# EAGLE design Serial Controlled Module (EAGLE 7.5.0)
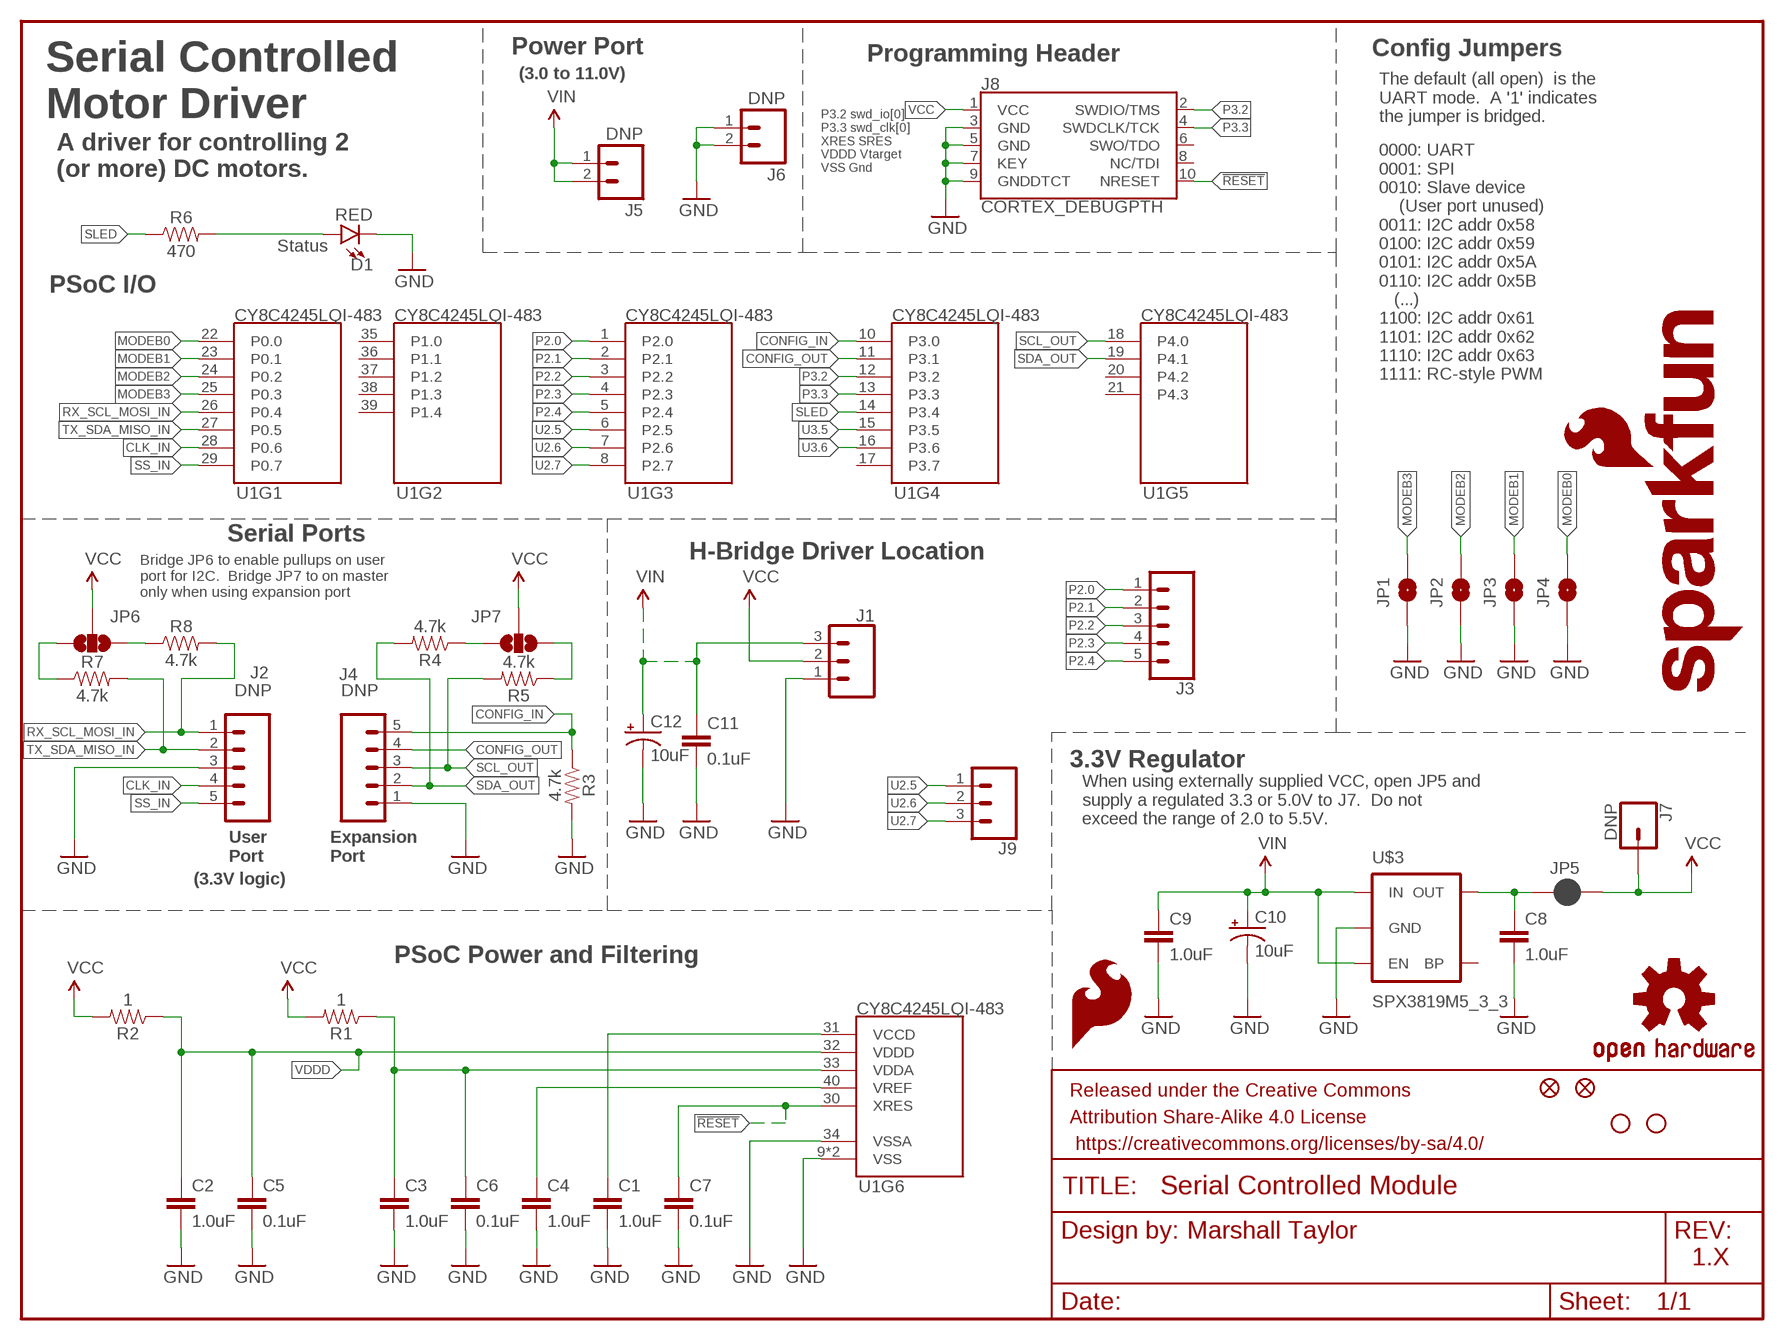
[diagram p0: schematic, sheet 1]

## Parts
C1  1.0uF  1.0UF-0402-16V-10%  [0402]
C2  1.0uF  1.0UF-0402-16V-10%  [0402]
C3  1.0uF  1.0UF-0402-16V-10%  [0402]
C4  1.0uF  1.0UF-0402-16V-10%  [0402]
C5  0.1uF  0.1UF-0402-16V-10%  [0402]
C6  0.1uF  0.1UF-0402-16V-10%  [0402]
C7  0.1uF  0.1UF-0402-16V-10%  [0402]
C8  1.0uF  1.0UF-0402-16V-10%  [0402]
C9  1.0uF  1.0UF-0402-16V-10%  [0402]
C10  10uF  10UF-POLAR-EIA3216-16V-10%(TANT)  [EIA3216]
C11  0.1uF  0.1UF-0402-16V-10%  [0402]
C12  10uF  10UF-POLAR-EIA3216-16V-10%(TANT)  [EIA3216]
D1  RED  LED-RED0603  [LED-0603]
FD1  FIDUCIALUFIDUCIAL  [MICRO-FIDUCIAL]
FD2  FIDUCIALUFIDUCIAL  [MICRO-FIDUCIAL]
FRAME1  FRAME-LETTER  [CREATIVE_COMMONS]
H3  STAND-OFF  [STAND-OFF]
H4  STAND-OFF  [STAND-OFF]
J1  CONN_03PTH  [1X03]
J2  DNP  M05PTH  [1X05@1]
J3  CONN_05PTH  [1X05]
J4  DNP  M05PTH  [1X05@1]
J5  DNP  M02PTH  [1X02@1]
J6  DNP  M02PTH  [1X02@1]
J7  DNP  CONN_01PTH  [1X01]
J8  CORTEX_DEBUGPTH  [2X5-PTH-1.27MM]
J9  CONN_03PTH  [1X03]
JP1  JUMPER-PAD-2  JUMPER-PAD-2-NOYES_SILK  [PAD-JUMPER-2-NO_YES_SILK]
JP2  JUMPER-PAD-2  JUMPER-PAD-2-NOYES_SILK  [PAD-JUMPER-2-NO_YES_SILK]
JP3  JUMPER-PAD-2  JUMPER-PAD-2-NOYES_SILK  [PAD-JUMPER-2-NO_YES_SILK]
JP4  JUMPER-PAD-2  JUMPER-PAD-2-NOYES_SILK  [PAD-JUMPER-2-NO_YES_SILK]
JP5  JUMPER-PAD-2  JUMPER-PAD-2-NC_BY_PASTE  [PAD-JUMPER-2-NC_BY_PASTE_YES_SILK]
JP6  JUMPER-PAD-3-NOYES_SILK  [PAD-JUMPER-3-NO_YES_SILK]
JP7  JUMPER-PAD-3-NOYES_SILK  [PAD-JUMPER-3-NO_YES_SILK]
LOGO1  SFE_LOGO_FLAME.1_INCH  [SFE_LOGO_FLAME_.1]
LOGO2  OSHW-LOGOMINI  [OSHW-LOGO-MINI]
LOGO3  SFE_LOGO_NAME_FLAME.1_INCH  [SFE_LOGO_NAME_FLAME_.1]
R1  1  1OHM-0603-1/10W-1%  [0603]
R2  1  1OHM-0603-1/10W-1%  [0603]
R3  4.7k  4.7KOHM-0603-1/10W-1%  [0603]
R4  4.7k  4.7KOHM-0603-1/10W-1%  [0603]
R5  4.7k  4.7KOHM-0603-1/10W-1%  [0603]
R6  470  470OHM-0603-1/10W-1%  [0603]
R7  4.7k  4.7KOHM-0603-1/10W-1%  [0603]
R8  4.7k  4.7KOHM-0603-1/10W-1%  [0603]
U1  CY8C4245LQI-483  CY8C4245LQI  [QFN-40]
U$3  SPX3819M5_3_3  SPX3819  [SOT-23-5-VREG]

## Nets
!RESET: C7.1 J8.10(NRESET) U1.30(XRES)
CLK_IN: J2.4 U1.28(P0.6)
CONFIG_IN: J4.5 R3.1 U1.10(P3.0)
CONFIG_OUT: J4.4 U1.11(P3.1)
GND: C1.2 C2.2 C3.2 C4.2 C5.2 C6.2 C7.2 C8.2 C9.2 C10.- C11.2 C12.- D1.C J1.1 J2.3 J4.1 J6.1 J6.2 J8.3(GND) J8.5(GND) J8.7(KEY) J8.9(GNDDTCT) JP1.1 JP2.1 JP3.1 JP4.1 R3.2 U1.9(VSS) U1.34(VSSA) U1.EP(VSS) U$3.2(GND)
MODEB0: JP4.2 U1.22(P0.0)
MODEB1: JP3.2 U1.23(P0.1)
MODEB2: JP2.2 U1.24(P0.2)
MODEB3: JP1.2 U1.25(P0.3)
N$1: C1.1 U1.31(VCCD)
N$2: JP7.1 R4.1
N$3: C3.1 C6.1 R1.1 U1.33(VDDA)
N$4: C4.1 U1.40(VREF)
N$5: C8.1 JP5.1 U$3.5(OUT)
N$6: JP7.3 R5.1
N$10: D1.A R6.2
N$11: JP6.1 R8.1
N$12: JP6.3 R7.1
P2.0: J3.1 U1.1(P2.0)
P2.1: J3.2 U1.2(P2.1)
P2.2: J3.3 U1.3(P2.2)
P2.3: J3.4 U1.4(P2.3)
P2.4: J3.5 U1.5(P2.4)
P3.2: J8.2(SWDIO/TMS) U1.12(P3.2)
P3.3: J8.4(SWDCLK/TCK) U1.13(P3.3)
RX_SCL_MOSI_IN: J2.1 R8.2 U1.26(P0.4)
SCL_OUT: J4.3 R5.2 U1.18(P4.0)
SDA_OUT: J4.2 R4.2 U1.19(P4.1)
SLED: R6.1 U1.14(P3.4)
SS_IN: J2.5 U1.29(P0.7)
TX_SDA_MISO_IN: J2.2 R7.2 U1.27(P0.5)
U2.5: J9.1 U1.6(P2.5)
U2.6: J9.2 U1.7(P2.6)
U2.7: J9.3 U1.8(P2.7)
U3.5: U1.15(P3.5)
U3.6: U1.16(P3.6)
VCC: J1.2 J7.1 J8.1(VCC) JP5.2 JP6.2 JP7.2 R1.2 R2.2
VDDD: C2.1 C5.1 R2.1 U1.32(VDDD)
VIN: C9.1 C10.+ C11.1 C12.+ J1.3 J5.1 J5.2 U$3.1(IN) U$3.3(EN)
Unconnected: J8.6(SWO/TDO) J8.8(NC/TDI) U1.17(P3.7) U1.20(P4.2) U1.21(P4.3) U1.35(P1.0) U1.36(P1.1) U1.37(P1.2) U1.38(P1.3) U1.39(P1.4) U$3.4(BP)

## Notes on the sheet
- Serial Controlled
  Motor Driver
- Power Port | Programming Header | Config Jumpers
- The default (all open)  is the
  UART mode.  A '1' indicates
  the jumper is bridged.
- (3.0 to 11.0V)
- P3.2 swd_io[0]
  P3.3 swd_clk[0]
  XRES SRES
  VDDD Vtarget
  VSS Gnd
- A driver for controlling 2
  (or more) DC motors.
- 0000: UART
  0001: SPI
  0010: Slave device
      (User port unused)
  0011: I2C addr 0x58
  0100: I2C addr 0x59
  0101: I2C addr 0x5A
  0110: I2C addr 0x5B
     (...)
  1100: I2C addr 0x61
  1101: I2C addr 0x62
  1110: I2C addr 0x63
  1111: RC-style PWM
- Status
- PSoC I/O
- Serial Ports
- Bridge JP6 to enable pullups on user
  port for I2C.  Bridge JP7 to on master
  only when using expansion port
- H-Bridge Driver Location
- 3.3V Regulator
- When using externally supplied VCC, open JP5 and
  supply a regulated 3.3 or 5.0V to J7.  Do not
  exceed the range of 2.0 to 5.5V.
- User
  Port
- Expansion
  Port
- (3.3V logic)
- PSoC Power and Filtering
- Marshall Taylor
- 1.X

## Library data of the parts
C1-C4 C8 C9 = SparkFun-Capacitors:1.0UF: 1µF ceramic capacitors A capacitor is a passive two-terminal electrical component used to store electrical energy temporarily in an electric field.; PROD_ID: CAP-12417
C5-C7 C11 = SparkFun-Capacitors:0.1UF: 0.1µF ceramic capacitors A capacitor is a passive two-terminal electrical component used to store electrical energy temporarily in an electric field.; PROD_ID: CAP-12416
C10 C12 = SparkFun-Capacitors:10UF-POLAR: 10.0µF polarized capacitors A capacitor is a passive two-terminal electrical component used to store electrical energy temporarily in an electric field.; PROD_ID: CAP-00811
D1 = SparkFun-LED:LED-RED: Red SMD LED Used in manufacturing of most products at SparkFun Packages: 0603 - SMD 0603 package [Product Link] <http://docs.avagotech.com/docs/AV02-0551EN> 0603 SMART - SMD 0603 SMART package ( more efficient and expensive)[Product Link] <http://www.osram-os.com/Graphics/XPic2/00077099_0.pdf> 1206 - SMD1206 package [Product Link] <https://www.sparkfun.com/datasheets/DevTools/LilyPad/Q150OVS4.pdff> SparkFun Products: Pro Mini 328 -5V <https://www.sparkfun.com/products/821> RedBoard <https://www.sparkfun.com/products/12757> IOIO-OTG <https://www.sparkfun.com/products/13613>; PROD_ID: DIO-00819
FD1 FD2 = SparkFun-Aesthetics:FIDUCIAL: Fiducial Alignment Points Various fiducial points for machine vision alignment.
FRAME1 = SparkFun-Aesthetics:FRAME-LETTER: Schematic Frame Standard 8.5x11 US Letter frame
H3 H4 = SparkFun-Electromechanical:STAND-OFF: #4 Stand Off This is the mechanical footprint for a #4 phillips button head screw. Use the keepout ring to avoid running the screw head into surrounding components. SKU : PRT-00447
J1 J9 = SparkFun-Connectors:CONN_03: Header 3 Standard 3-pin 0.1" header. Use with straight break away headers (SKU : PRT-00116), right angle break away headers (PRT-00553), swiss pins (PRT-00743), machine pins (PRT-00117), and female headers (PRT-00115). Molex polarized connector foot print use with SKU : PRT-08232 with associated crimp pins and housings.
J2 J4 = SparkFun-Connectors:M05: Header 5 Standard 5-pin 0.1" header. Use with straight break away headers (SKU : PRT-00116), right angle break away headers (PRT-00553), swiss pins (PRT-00743), machine pins (PRT-00117), and female headers (PRT-00115). Molex polarized connector foot print use with SKU : PRT-08230 with associated crimp pins and housings.
J3 = SparkFun-Connectors:CONN_05: Header 5 Standard 5-pin 0.1" header. Use with straight break away headers (SKU : PRT-00116), right angle break away headers (PRT-00553), swiss pins (PRT-00743), machine pins (PRT-00117), and female headers (PRT-00115). Molex polarized connector foot print use with SKU : PRT-08230 with associated crimp pins and housings.
J5 J6 = SparkFun-Connectors:M02: Standard 2-pin 0.1" header. Use with - straight break away headers ( PRT-00116) - right angle break away headers (PRT-00553) - swiss pins (PRT-00743) - machine pins (PRT-00117) - female headers (PRT-00115) Molex polarized connector foot print use with: PRT-08233 with associated crimp pins and housings. 2.54_SCREWTERM for use with PRT-10571. 3.5mm Screw Terminal footprints for PRT-08084 5mm Screw Terminal footprints for use with PRT-08432
J7 = SparkFun-Connectors:CONN_01: Header 1 Standard 1-pin 0.1" header. Use with straight break away headers (SKU : PRT-00116), right angle break away headers (PRT-00553), swiss pins (PRT-00743), machine pins (PRT-00117), and female headers (PRT-00115). SMTSO-256-ET is a "flush mount" nut for a 4-40 screw. The older package used to be too tight, and did not allow it to sit properly thru the drill hit. The latest (0.165DIA) fits nice and snug.
J8 = Pete_Connectors_Retired:CORTEX_DEBUG: Cortex Debug Connector Datasheet <http://infocenter.arm.com/help/topic/com.arm.doc.faqs/attached/13634/cortex_debug_connectors.pdf>
JP1-JP4 = SparkFun-Passives:JUMPER-PAD-2-NO
JP5 = SparkFun-Jumpers:JUMPER-PAD-2-NC_BY_PASTE
JP6 JP7 = SparkFun-Passives:JUMPER-PAD-3-NO
LOGO1 = SparkFun-Aesthetics:SFE_LOGO_FLAME: SFE Logo, flame only This is the SparkFun flame logo. The logo on the schematic will always be the same size; the package variant is the height of the flame. Default layer for the logo on the board is tSilk.
LOGO2 = SparkFun-Aesthetics:OSHW-LOGO: Open Source Hardware Logo This logo indicates the piece of hardware it is found on incorporates a OSHW license and/or adheres to the definition of open source hardware found here: http://freedomdefined.org/OSHW
LOGO3 = SparkFun-Aesthetics:SFE_LOGO_NAME_FLAME: SFE Logo, name and flame This is the SparkFun full logo. The logo on the schematic will always be the same size; the package variant is the height of the flame part of the logo. Default layer for the logo on the board is tSilk.
R1 R2 = SparkFun-Resistors:1OHM: 1Ω resistor A resistor is a passive two-terminal electrical component that implements electrical resistance as a circuit element. Resistors act to reduce current flow, and, at the same time, act to lower voltage levels within circuits.; PROD_ID: RES-08269
R3-R5 R7 R8 = SparkFun-Resistors:4.7KOHM: 4.7kΩ resistor A resistor is a passive two-terminal electrical component that implements electrical resistance as a circuit element. Resistors act to reduce current flow, and, at the same time, act to lower voltage levels within circuits.; PROD_ID: RES-07857
R6 = SparkFun-Resistors:470OHM: 470Ω resistor A resistor is a passive two-terminal electrical component that implements electrical resistance as a circuit element. Resistors act to reduce current flow, and, at the same time, act to lower voltage levels within circuits.; PROD_ID: RES-07869
U1 = PSOC4TempLib:CY8C4245LQI: PSOC 4200; PROD_ID: IC-13292
U$3 = PSOC4TempLib:SPX3819; PROD_ID: VREG-13321

## Board
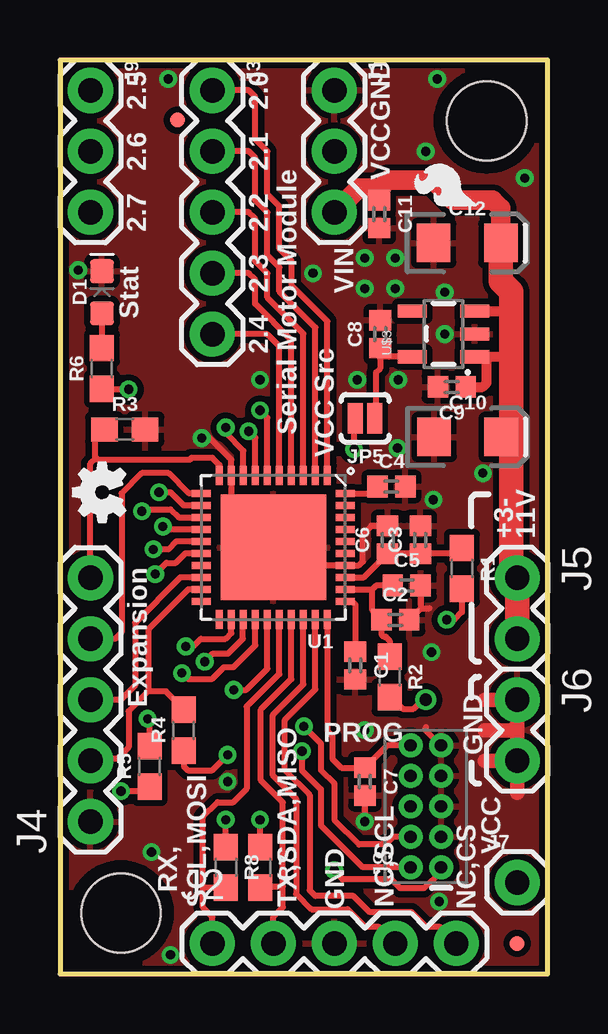
[diagram p1: board, top side]
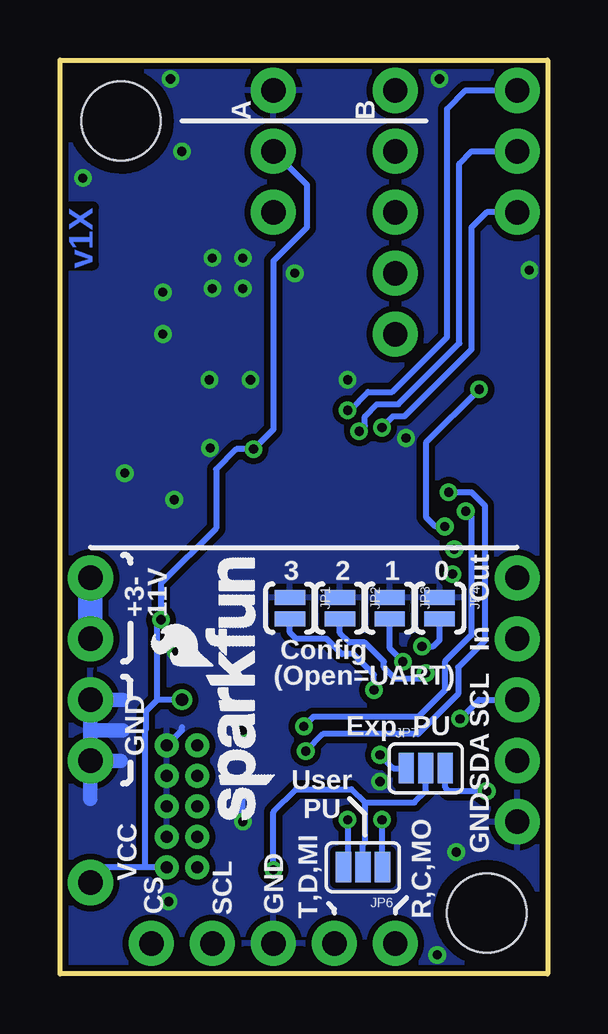
[diagram p2: board, bottom side, seen from below]

Size 20.32 x 38.1 mm. Coordinates in mm from the lower left corner, seen from the top.
Outline: 0,0 20.32,0 20.32,38.1 0,38.1 0,0
Copper layers (1*16): Top 0.035mm / dielectric 1.5mm / Bottom 0.035mm
Design rules "SparkFun-2-layer-TIGHT": minimum track width 7mil, minimum drill 15mil, track to track 7mil, track to pad 7mil, pad to pad 7mil, via to via 7mil, smd to smd 7mil, copper to edge 7mil, drill to drill 7mil, minimum pad ring 7mil, minimum via ring 7mil, stop-mask expansion 4mil, vias tented up to drill 25mil, thermal gap 10mil

### Footprints (pad centres in the part's own frame; a part is rotated, then mirrored left to right if it is on the bottom)
0402 = smd 0.85 x 0.9: 1 -0.58,0; 2 0.58,0
EIA3216 = smd 1.4 x 1.6: + 1.4,0; - -1.4,0
LED-0603 = smd 1 x 1: A -0.877,0; C 0.877,0
MICRO-FIDUCIAL = smd 0.635 x 0.635: 1 0,0
STAND-OFF = hole 3.302: 0,0
1X03 = drill 1.016 pad 1.88: 1 0,0; 2 2.54,0; 3 5.08,0
1X05@1 = drill 1.016 pad 1.88: 1 0,0; 2 2.54,0; 3 5.08,0; 4 7.62,0; 5 10.16,0
1X05 = drill 1.016 pad 1.88: 1 0,0; 2 2.54,0; 3 5.08,0; 4 7.62,0; 5 10.16,0
1X02@1 = drill 1.016 pad 1.88: 1 0,0; 2 2.54,0
1X01 = drill 1.016 pad 1.88: 1 0,0
2X5-PTH-1.27MM = drill 0.508 pad 1: 1 -2.54,-0.635; 2 -2.54,0.635; 3 -1.27,-0.635; 4 -1.27,0.635; 5 0,-0.635; 6 0,0.635; 7 1.27,-0.635; 8 1.27,0.635; 9 2.54,-0.635; 10 2.54,0.635
PAD-JUMPER-2-NO_YES_SILK = smd 0.635 x 1.27: 1 -0.45,0; 2 0.45,0
PAD-JUMPER-2-NC_BY_PASTE_YES_SILK = smd 0.635 x 1.27: 1 -0.401,0; 2 0.413,0
PAD-JUMPER-3-NO_YES_SILK = smd 0.635 x 1.27: 1 -0.813,0; 2 0,0; 3 0.813,0
0603 = smd 1.1 x 1: 1 -0.85,0; 2 0.85,0
QFN-40 = smd 0.285 x 0.8: 1 -2.25,-3; 2 -1.75,-3; 3 -1.25,-3; 4 -0.75,-3; 5 -0.25,-3; 6 0.25,-3; 7 0.75,-3; 8 1.25,-3; 9 1.75,-3; 10 2.25,-3; 21 2.25,3; 22 1.75,3; 23 1.25,3; 24 0.75,3; 25 0.25,3; 26 -0.25,3; 27 -0.75,3; 28 -1.25,3; 29 -1.75,3; 30 -2.25,3 | smd 0.8 x 0.285: 11 3,-2.25; 12 3,-1.75; 13 3,-1.25; 14 3,-0.75; 15 3,-0.25; 16 3,0.25; 17 3,0.75; 18 3,1.25; 19 3,1.75; 20 3,2.25; 31 -3,2.25; 32 -3,1.75; 33 -3,1.25; 34 -3,0.75; 35 -3,0.25; 36 -3,-0.25; 37 -3,-0.75; 38 -3,-1.25; 39 -3,-1.75; 40 -3,-2.25 | smd 4.4 x 4.4: EP 0,0
SOT-23-5-VREG = smd 0.55 x 1.2: 1 -0.95,-1.3; 2 0,-1.3; 3 0.95,-1.3; 4 0.95,1.3; 5 -0.95,1.3

### Placement (x,y rotation side)
C1  12.3,12.86 270 top
C2  13.97,14.76 0 top
C3  15.02,18.1 90 top
C4  13.81,20.32 0 top
C5  14.45,16.19 0 top
C6  13.65,18.1 90 top
C7  12.7,8.02 270 top
C8  13.34,26.67 90 top
C9  16.33,24.47 180 top
C10  16.99,22.38 0 top
C11  13.3,31.67 270 top
C12  16.97,30.47 0 top
D1  1.75,28.42 90 top
FD1  19.05,1.27 90 top
FD2  4.89,35.59 90 top
FRAME1  -21.59,-27.94 0 top  (outside the outline)
H3  17.78,35.56 0 top
H4  2.54,2.54 0 top
J1  11.43,36.83 270 top
J2  6.35,1.27 0 top
J3  6.35,36.83 270 top
J4  1.27,6.35 90 top
J5  19.05,16.51 270 top
J6  19.05,11.43 270 top
J7  19.05,3.81 0 top
J8  15.24,6.99 90 top
J9  1.27,36.83 270 top
JP1  10.74,15.25 270 bottom
JP2  8.66,15.25 270 bottom
JP3  6.58,15.25 270 bottom
JP4  4.5,15.25 270 bottom
JP5  12.72,23.16 180 top
JP6  7.7,4.45 180 bottom
JP7  5.08,8.57 0 bottom
LOGO1  17.68,31.73 90 top
LOGO2  1.75,20.08 90 top
LOGO3  11.31,5.99 90 bottom
R1  16.75,16.91 270 top
R2  13.73,12.38 270 top
R3  2.7,22.7 0 top
R4  5.16,10.16 90 top
R5  3.73,8.65 90 top
R6  1.75,25.24 90 top
R7  8.33,4.45 270 top
R8  6.91,4.45 270 top
U1  8.89,17.78 180 top
U$3  15.98,26.68 90 top

### Tracks (layer width: path | path; a pad name or v marks a point on that pad's centre or on a via)
!RESET
  Top 0.254: U1.30 11.14,10.13 11.35,9.92 11.35,8.97 11.72,8.6 C7.1 13.63,9.53 J8.10
CLK_IN
  Top 0.254: J2.4 13.26,1.98 12.7,1.98 11.99,2.7 10.48,2.7 9.84,3.33 9.84,7.3 8.87,8.28 8.87,10.81 10.14,12.08 U1.28
CONFIG_IN
  Top 0.254: U1.10 6.64,21.22 6.35,21.51 5.48,21.51 5.4,21.43 1.59,21.43 1.51,21.51 | J4.5 1.27,21.27 1.51,21.51 | R3.1 1.75,22.7 1.45,22.41 1.45,21.57 1.51,21.51
CONFIG_OUT
  Top 0.254: J4.4 2.3,13.97 2.57,14.24 2.57,20.03 3.41,20.88 4.52,20.88 5.37,20.03 U1.11
GND  (via drill 0.38)
  Top 0.254: C6.2 12.96,18.68 12.62,18.34 12.62,17.19 12.46,17.03 U1.34 10.67,17.03 10.48,17.22 9.45,17.22 U1.EP | 7.38,19.21 7.14,19.45 U1.9 7.14,21.43 6.19,22.38 | C7.2 v12.7,6.35 | C1.2 12.28,12.28 | C5.2 15.03,15.24 | 15.03,15.24 C2.2 | 15.03,15.24 15.4,15.24 | J8.9 15.24,10.16 15.24,10.29
  Top 0.61: 17.7,10.16 19.05,10.16 | 17.7,11.43 J6.1 19.05,10.16 | 17.7,8.89 J6.2 | 19.05,7.54 J6.2 | J6.2 19.05,10.16
  Bottom 0.254: v12.7,6.35 12.7,7.62 | J8.9 15.24,10.16 15.24,10.29
  Bottom 0.61: 17.7,11.43 J6.1 19.05,10.16 | 19.05,10.16 J6.2 | J6.2 19.05,7.3 | J6.2 17.78,8.89 | 19.05,10.16 17.7,10.16
  other vias: 19.37,33.18 15.72,37.31 13.97,28.57 13.97,29.84 12.7,29.84 15.24,34.29 4.51,37.31 16.03,26.67 16.03,28.42 17.62,20.88 15.56,19.76 14.1,24.77 14.07,21.92 8.33,24.77 0.76,29.34 15.48,13.41 15.8,3.02 3.81,5.08 6.99,8.02 12.7,10.16 4.6,0.79 5.91,22.34 10.54,29.21 12.38,24.77 12.7,28.57
  pour Bottom (isolate 0.254): 0,38.1 0,0 20.32,0 20.32,38.1
  pour Top (isolate 0.254, rank 2): 0,38.1 0,0 20.32,0 20.32,38.1
MODEB0  (via drill 0.38)
  Top 0.254: v5.24,13.65 5.56,13.65 5.87,13.97 6.9,13.97 7.14,14.2 U1.22
  Bottom 0.254: v5.24,13.65 4.76,13.65 4.5,13.91 JP4.2
MODEB1  (via drill 0.38)
  Top 0.254: v6.03,13.02 6.37,13.36 7,13.36 7.62,13.97 7.62,14.76 U1.23
  Bottom 0.254: v6.03,13.02 6.58,13.56 JP3.2
MODEB2  (via drill 0.38)
  Top 0.254: v5.08,12.54 5.32,12.3 6.35,12.3 6.83,12.78 7.22,12.78 8.14,13.7 U1.24
  Bottom 0.254: JP2.2 8.66,14.22 8.26,13.81 7.62,13.81 6.83,13.02 6.83,12.78 6.35,12.3 5.32,12.3 v5.08,12.54
MODEB3  (via drill 0.38)
  Top 0.254: v7.24,11.84 7.76,11.84 8.64,12.72 U1.25
  Bottom 0.254: JP1.2 10.74,14.23 10.48,13.97 9.21,13.97 8.57,13.34 8.1,13.34 7.24,12.48 v7.24,11.84
N$1
  Top 0.254: U1.31 12.17,15.53 12.3,15.4 C1.1
N$2  (via drill 0.38)
  Top 0.254: R4.1 5.16,8.65 5.32,8.49 6.35,8.49 v6.99,9.13
  Bottom 0.254: v6.99,9.13 6.43,8.57 JP7.1
N$3
  Top 0.254: U1.33 12.66,16.53 C6.1 C3.1 16.51,17.52 R1.1
N$4
  Top 0.254: U1.40 12.94,20.03 C4.1
N$5
  Top 0.203: 13.41,25.73 13.34,25.65
  Top 0.254: U$3.5 13.71,25.73 | 13.71,25.73 C8.1 | 13.71,25.73 13.41,25.73 | 13.34,25.65 13.34,25.24 13.17,25.07 13.17,23.16 JP5.1
N$6  (via drill 0.38)
  Top 0.254: R5.1 3.55,7.62 v2.54,7.62
  Bottom 0.254: v2.54,7.62 4.13,7.62 4.27,7.76 JP7.3
N$10
  Top 0.254: D1.A R6.2
N$11  (via drill 0.38)
  Top 0.254: R8.1 v6.91,6.43
  Bottom 0.254: v6.91,6.43 6.91,4.46 JP6.1
N$12  (via drill 0.38)
  Top 0.254: R7.1 v8.33,6.43
  Bottom 0.254: v8.33,6.43 8.33,4.62 JP6.3
P2.0
  Top 0.254: U1.1 11.14,27.21 9.65,28.7 9.65,29.72 9.14,30.23 9.14,32 8.64,32.51 8.64,34.29 8.13,34.8 8.13,36.58 7.87,36.83 J3.1
P2.1
  Top 0.254: U1.2 10.64,26.95 9.14,28.45 9.14,29.46 8.64,29.97 8.64,31.75 8.13,32.26 8.13,34.04 7.87,34.29 J3.2
P2.2
  Top 0.254: U1.3 10.14,26.69 8.64,28.19 8.64,29.21 8.13,29.72 8.13,31.5 7.87,31.75 J3.3
P2.3
  Top 0.254: U1.4 9.64,26.43 8.13,27.94 8.13,28.96 7.87,29.21 J3.4
P2.4
  Top 0.254: U1.5 9.14,26.17 8.64,26.67 J3.5
P3.2  (via drill 0.38)
  Top 0.254: J8.2 12.62,4.45 10.87,6.19 10.87,7.7 10.08,8.49 v10.08,9.29 | v4.13,20.08 4.6,20.08 5.16,19.53 U1.12
  Bottom 0.254: v10.08,9.29 9.37,10 5.4,10 3.73,11.67 3.73,12.78 2.62,13.89 2.62,19.53 3.17,20.08 v4.13,20.08
P3.3  (via drill 0.38)
  Top 0.254: v10.16,10.32 10.87,9.6 10.87,8.49 11.43,7.94 11.43,6.43 12.46,5.4 13.57,5.4 13.89,5.71 J8.4 | v3.41,19.29 3.49,19.37 4.6,19.37 4.94,19.03 U1.13
  Bottom 0.254: v10.16,10.32 9.76,10.72 5.4,10.72 4.29,11.83 4.29,13.02 3.17,14.13 3.17,19.05 v3.41,19.29
RX_SCL_MOSI_IN
  Top 0.254: J2.1 6.35,2.38 5.95,2.78 5.95,3.57 | 5.95,3.57 5.95,6.54 6.57,7.16 7.22,7.16 7.78,7.71 7.78,11.14 9.14,12.51 U1.26 | R8.2 5.98,3.6 5.95,3.57
SCL_OUT  (via drill 0.38)
  Top 0.254: U1.18 5.02,16.53 3.13,14.64 3.13,12.02 2.54,11.43 J4.3 | R5.2 3.73,10.56 v3.65,10.64
  Bottom 0.254: v3.65,10.64 2.86,11.43 J4.3
SDA_OUT
  Top 0.254: U1.19 5.35,16.03 3.68,14.37 3.68,11.78 | 3.68,11.78 2.86,10.95 2.86,9.45 2.38,8.97 1.35,8.97 J4.2 | R4.2 5.16,11.03 4.41,11.78 3.68,11.78
SLED  (via drill 0.38)
  Top 0.254: v2.86,24.37 1.77,24.37 R6.1 | U1.14 4.41,18.53 v4.29,18.65
  Bottom 0.254: v4.29,18.65 4.68,18.65 5.08,19.05 5.08,22.15 v2.86,24.37
SS_IN
  Top 0.254: J2.5 15.8,1.98 15.24,1.98 14.65,2.57 12.91,2.57 12.22,3.25 10.64,3.25 10.4,3.49 10.4,7.46 9.37,8.49 9.37,10.59 10.64,11.86 U1.29
TX_SDA_MISO_IN
  Top 0.254: J2.2 8.89,2.38 9.29,2.78 9.29,3.65 | 9.29,3.65 9.29,7.14 8.37,8.06 8.37,11.02 9.64,12.29 U1.27 | R7.2 8.39,3.65 9.29,3.65
U2.5  (via drill 0.38)
  Top 0.254: U1.6 8.64,23.19 v8.33,23.5
  Bottom 0.254: v8.33,23.5 8.26,23.5 7.49,24.26 6.48,24.26 4.19,26.54 4.19,36.07 3.43,36.83 J9.1
U2.6  (via drill 0.38)
  Top 0.254: U1.7 8.14,22.34 v7.86,22.62
  Bottom 0.254: v7.86,22.62 7.62,22.86 7.62,23.24 7.11,23.75 6.22,23.75 3.68,26.29 3.68,33.78 3.17,34.29 J9.2
U2.7  (via drill 0.38)
  Top 0.254: U1.8 7.64,21.81 6.91,22.54 v6.91,22.78
  Bottom 0.254: J9.3 2.54,31.75 3.17,31.11 3.17,26.04 5.97,23.24 6.45,23.24 v6.91,22.78
U3.5  (via drill 0.38)
  Top 0.254: U1.15 4.85,18.03 4.52,17.7 v3.89,17.7
U3.6  (via drill 0.38)
  Top 0.254: U1.16 5.23,17.53 4.83,17.13 4.43,17.13 v3.97,16.67
VCC  (via drill 0.38, 0.51)
  Top 0.254: J8.1 15.88,4.29 15.16,3.57 14.18,3.57 13.81,3.94 11.78,3.94 11.43,4.29 v11.43,4.33 | 13.81,11.51 13.49,11.19 | R1.2 16.75,15.08 16.43,14.76 v16.11,14.76 | 13.81,11.51 14.27,11.05 14.73,11.05 15.11,11.43 v15.24,11.43 | R2.2 13.79,11.53 13.81,11.51 | v12.26,21.88 12.27,21.86 12.27,23.16 JP5.2
  Bottom 0.254: JP6.2 7.7,5.4 7.62,5.48 7.62,7.14 | v11.43,4.33 11.43,6.75 10.48,7.7 8.18,7.7 7.62,7.14 | v15.24,11.43 16.27,11.43 | 16.27,11.43 16.75,10.95 16.75,10.18 16.76,10.16 16.76,4.46 16.75,4.45 | 16.27,11.43 16.27,14.61 v16.11,14.76 16.11,16.27 13.81,18.57 13.81,21.03 12.97,21.88 v12.26,21.88 11.43,22.7 11.43,29.72 10.03,31.11 10.03,32.89 J1.2 | 7.62,7.14 5.56,7.14 5.08,7.62 JP7.2 | J8.1 16.75,4.45 | 16.75,4.45 18.41,4.45 J7.1
VDDD
  Top 0.254: C5.1 13.18,16.19 13.01,16.03 | U1.32 13.01,16.03 | 13.01,16.03 13.02,16.03 13.02,15.16 13.39,14.79 C2.1 13.39,14.15 13.49,14.05 13.57,14.05 13.73,13.89 R2.1
VIN
  Top 0.254: 18.74,27.63 18.8,27.69 | U$3.1 17.78,25.73 | 18.72,25.73 18.8,25.65 | C11.1 13.3,32.35 13.97,33.02 13.97,33.09
  Top 0.406: U$3.3 18.74,27.63 | 18.72,25.73 17.78,25.73 17.78,24.64 17.61,24.47 C9.1
  Top 0.813: C12.+ 18.37,31.92 18.03,32.26 16.37,32.26 15.54,33.09 13.97,33.09 13.66,33.09 13.34,32.77 12.45,32.77 J1.3 | C10.+ 18.64,22.38 18.8,22.23
  Top 1.016: C12.+ 18.37,28.87 18.8,28.45 18.8,27.69 18.8,25.65 18.8,22.23 18.8,16.76 J5.1 J5.2
  Bottom 1.016: J5.2 J5.1

### Text on the board
Bottom: v1X
tPlace: 2.5 | 2.0 | GND | 2.6 | 2.1 | VCC | 2.7 | 2.2 | 2.3 | VIN | Stat | Serial Motor Module | 2.4 | VCC Src | +3- / 11V | Expansion | PROG | GND | VCC | RX, / SCL,MOSI | TX,SDA,MISO | GND | NC,SCL | NC,CS
bPlace: B | A | Out | 0 | 1 | 2 | 3 | +3- / 11V | In | Config | (Open=UART) | SCL | Exp. PU | SDA | GND | User / PU | GND | VCC | GND | CS | R,C,MO | T,D,MI | SCL
Measures: Measurements in inches.
tDocu: Marshall Taylor